# Altium schematic sheet Microcontroller.SchDoc
size B; Organization: MASA; SheetNumber: 6; SheetTotal: 7
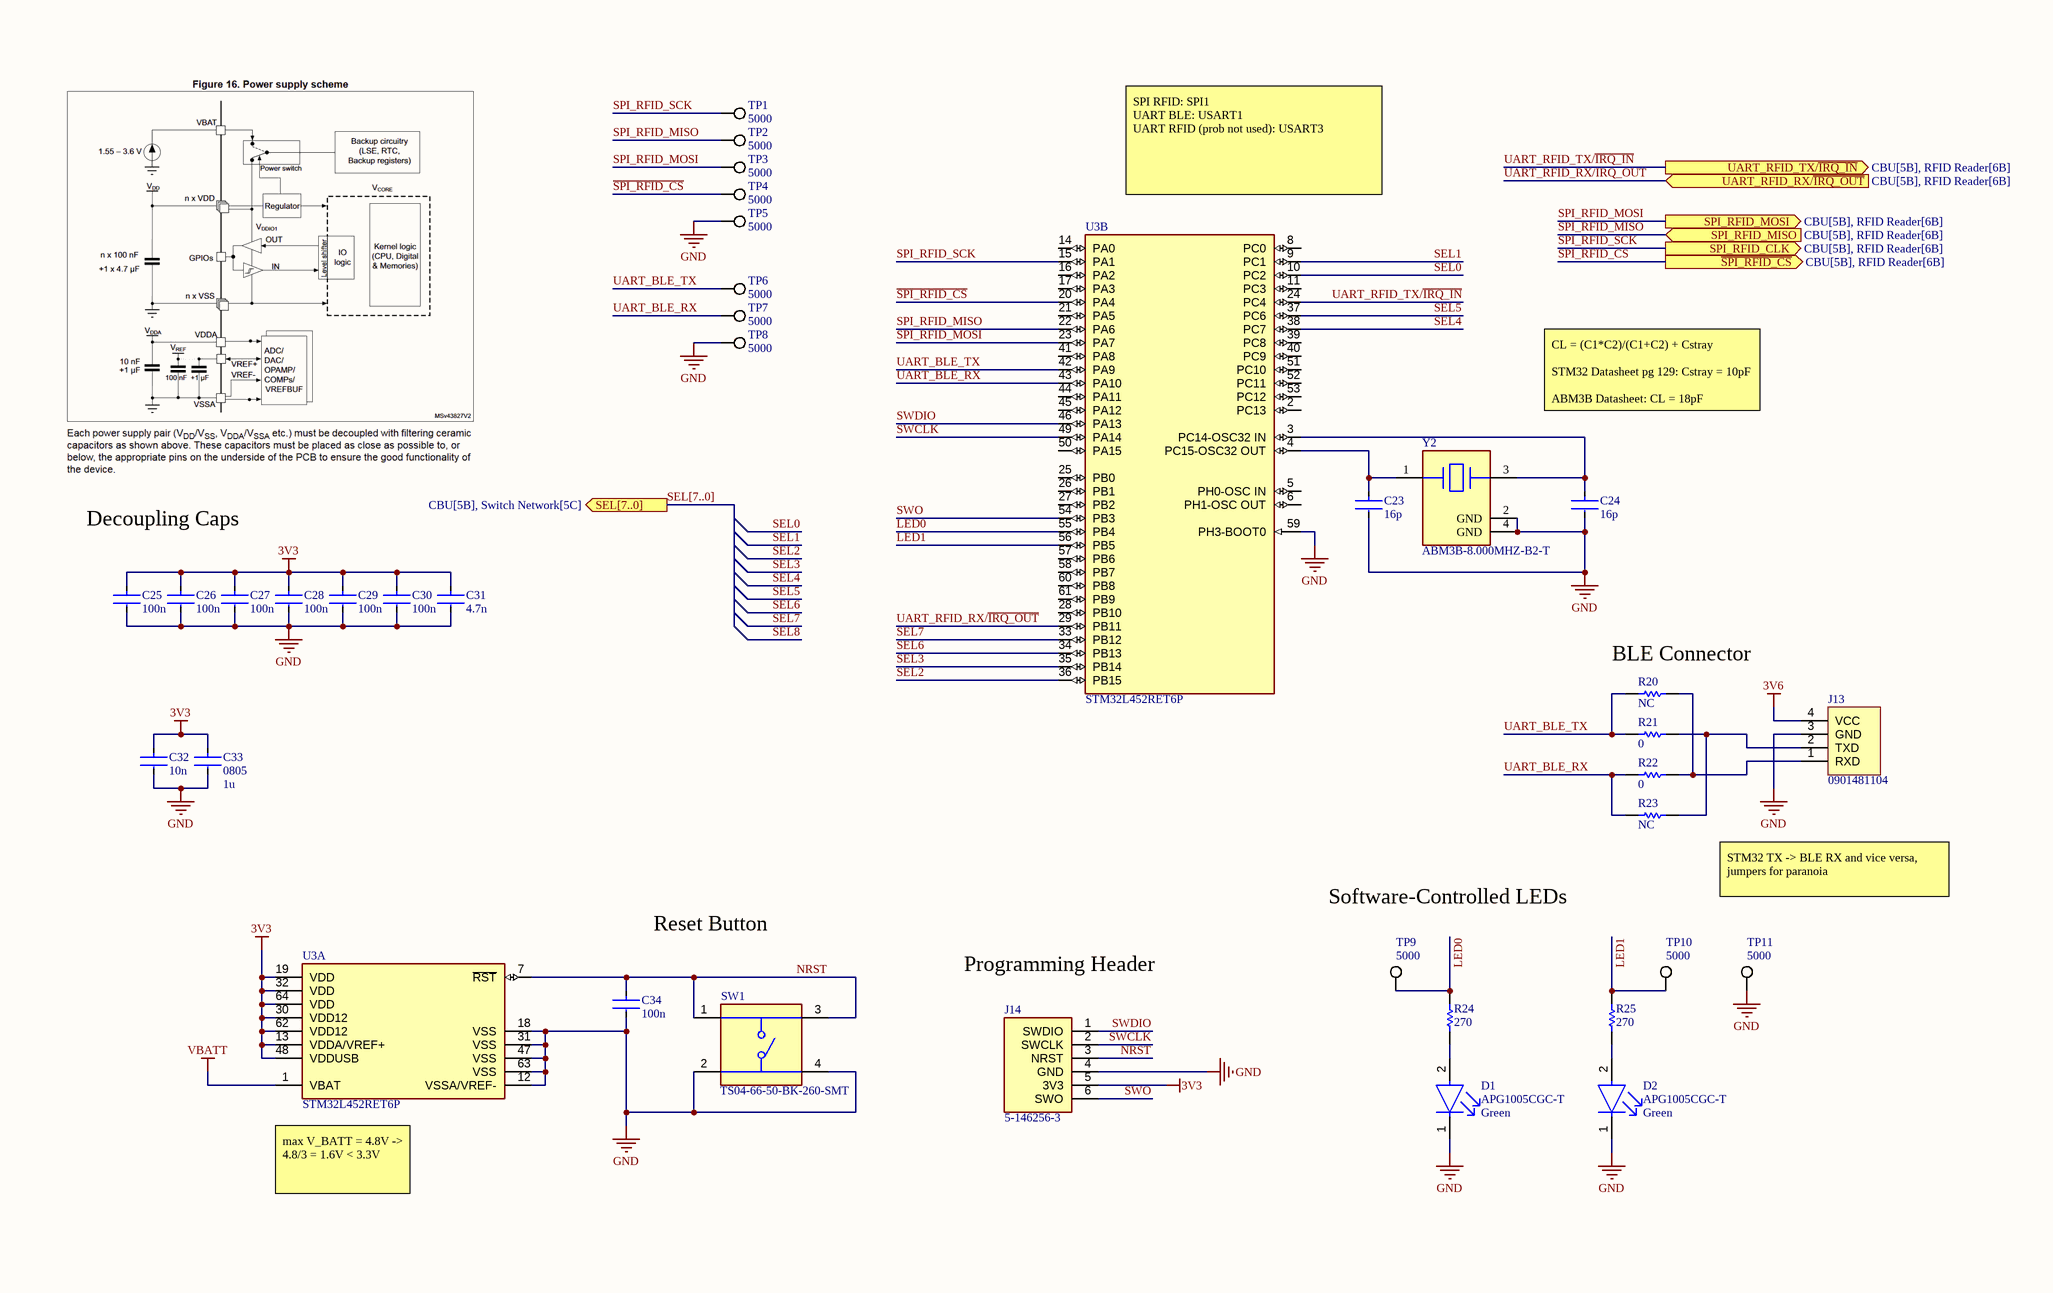
[diagram p0: Microcontroller.SchDoc]

## Parts
C23  value 16p  [FP-0603-Capacitor-CL10-IPC_B]  (hidden comment: Ceramic Capacitor 0603)
C24  value 16p  [FP-0603-Capacitor-CL10-IPC_B]  (hidden comment: Ceramic Capacitor 0603)
C25  value 100n  [FP-0603-Capacitor-CL10-IPC_B]  (hidden comment: Ceramic Capacitor 0603)
C26  value 100n  [FP-0603-Capacitor-CL10-IPC_B]  (hidden comment: Ceramic Capacitor 0603)
C27  value 100n  [FP-0603-Capacitor-CL10-IPC_B]  (hidden comment: Ceramic Capacitor 0603)
C28  value 100n  [FP-0603-Capacitor-CL10-IPC_B]  (hidden comment: Ceramic Capacitor 0603)
C29  value 100n  [FP-0603-Capacitor-CL10-IPC_B]  (hidden comment: Ceramic Capacitor 0603)
C30  value 100n  [FP-0603-Capacitor-CL10-IPC_B]  (hidden comment: Ceramic Capacitor 0603)
C31  value 4.7n  [FP-0603-Capacitor-CL10-IPC_B]  (hidden comment: Ceramic Capacitor 0603)
C32  value 10n  [FP-0603-Capacitor-CL10-IPC_B]  (hidden comment: Ceramic Capacitor 0603)
C33  value 1u  Package: 0805  [FP-0805-Capacitor-CL21-IPC_B]  (hidden comment: Ceramic Capacitor 0805)
C34  value 100n  [FP-0603-Capacitor-CL10-IPC_B]  (hidden comment: Ceramic Capacitor 0603)
D1  APG1005CGC-T  Color: Green  [FP-APG1005CGC-T-MFG]
D2  APG1005CGC-T  Color: Green  [FP-APG1005CGC-T-MFG]
J13  0901481104  [0901481104]
J14  5-146256-3  [TE_5-146256-3]
R20  value NC  [RESC1608X55X25NL10T15]  (hidden comment: RC0603FR-072K2L)
R21  value 0  [RESC1608X55X25NL10T15]  (hidden comment: RC0603FR-072K2L)
R22  value 0  [RESC1608X55X25NL10T15]  (hidden comment: RC0603FR-072K2L)
R23  value NC  [RESC1608X55X25NL10T15]  (hidden comment: RC0603FR-072K2L)
R24  value 270  [RESC1608X55X25NL10T15]  (hidden comment: RC0603FR-072K2L)
R25  value 270  [RESC1608X55X25NL10T15]  (hidden comment: RC0603FR-072K2L)
SW1  TS04-66-50-BK-260-SMT  [SW_TS04-66-50-BK-260-SMT]
TP1  5000  [FP-5000-MFG]
TP2  5000  [FP-5000-MFG]
TP3  5000  [FP-5000-MFG]
TP4  5000  [FP-5000-MFG]
TP5  5000  [FP-5000-MFG]
TP6  5000  [FP-5000-MFG]
TP7  5000  [FP-5000-MFG]
TP8  5000  [FP-5000-MFG]
TP9  5000  [FP-5000-MFG]
TP10  5000  [FP-5000-MFG]
TP11  5000  [FP-5000-MFG]
U3  STM32L452RET6P  [FP-STM32L452RET6P-MFG]  (parts A,B of 2)
Y2  ABM3B-8.000MHZ-B2-T  [FP-ABM3B-MFG]

## Ports
SEL[7..0] (out, see CBU[5B], Switch Network[5C]), SPI_RFID_CLK (out, see CBU[5B], RFID Reader[6B]), SPI_RFID_MISO (in, see CBU[5B], RFID Reader[6B]), SPI_RFID_MOSI (out, see CBU[5B], RFID Reader[6B]), UART_RFID_RX/~{IRQ_OUT} (in, see CBU[5B], RFID Reader[6B]), UART_RFID_TX/~{IRQ_IN} (out, see CBU[5B], RFID Reader[6B]), ~{SPI_RFID_CS} (out, see CBU[5B], RFID Reader[6B])

## Nets
3V3: C25.1 C26.1 C27.1 C28.1 C29.1 C30.1 C31.1 C32.1 C33.1 J14.5(3V3) U3.13(VDDA/VREF+) U3.19(VDD) U3.30(VDD12) U3.32(VDD) U3.48(VDDUSB) U3.62(VDD12) U3.64(VDD)
3V6: J13.4(VCC)
GND: C23.2 C24.2 C25.2 C26.2 C27.2 C28.2 C29.2 C30.2 C31.2 C32.2 C33.2 C34.2 D1.1(C) D2.1(C) J13.3(GND) J14.4(GND) SW1.2 SW1.4 TP5.1 TP8.1 TP11.1 U3.12(VSSA/VREF-) U3.18(VSS) U3.31(VSS) U3.47(VSS) U3.59(PH3-BOOT0) U3.63(VSS) Y2.2(GND) Y2.4(GND)
VBATT: U3.1(VBAT)
LED0: R24.2 TP9.1 U3.55(PB4)
LED1: R25.2 TP10.1 U3.56(PB5)
NRST: C34.1 J14.3(NRST) SW1.1 SW1.3 U3.7(~{RST})
~{SPI_RFID_CS}: TP4.1 U3.20(PA4) ; port ~{SPI_RFID_CS}
SEL0: U3.10(PC2)
SEL1: U3.9(PC1)
SEL2: U3.36(PB15)
SEL3: U3.35(PB14)
SEL4: U3.38(PC7)
SEL5: U3.37(PC6)
SEL6: U3.34(PB13)
SEL7: U3.33(PB12)
SPI_RFID_MISO: TP2.1 U3.22(PA6) ; port SPI_RFID_MISO
SPI_RFID_MOSI: TP3.1 U3.23(PA7) ; port SPI_RFID_MOSI
SPI_RFID_SCK: TP1.1 U3.15(PA1) ; port SPI_RFID_CLK
SWCLK: J14.2(SWCLK) U3.49(PA14)
SWDIO: J14.1(SWDIO) U3.46(PA13)
SWO: J14.6(SWO) U3.54(PB3)
UART_BLE_RX: R22.2 R23.1 TP7.1 U3.43(PA10)
UART_BLE_TX: R20.2 R21.1 TP6.1 U3.42(PA9)
UART_RFID_RX/~{IRQ_OUT}: U3.29(PB11) ; port UART_RFID_RX/~{IRQ_OUT}
UART_RFID_TX/~{IRQ_IN}: U3.24(PC4) ; port UART_RFID_TX/~{IRQ_IN}
NetC23_1: C23.1 U3.4(PC15-OSC32_OUT) Y2.1
NetC24_1: C24.1 U3.3(PC14-OSC32_IN) Y2.3
NetD1_2: D1.2(A) R24.1
NetD2_2: D2.2(A) R25.1
NetJ13_1: J13.1(RXD) R20.1 R22.1
NetJ13_2: J13.2(TXD) R21.2 R23.2

Not connected (* = marked no-connect by the designer): U3 2(PC13) 5(PH0-OSC_IN) 6(PH1-OSC_OUT) 8(PC0) 11(PC3) 14(PA0) 16(PA2) 17(PA3) 21(PA5) 25(PB0) 26(PB1) 27(PB2) 28(PB10) 39(PC8) 40(PC9) 41(PA8) 44(PA11) 45(PA12) 50(PA15) 51(PC10) 52(PC11) 53(PC12) 57(PB6) 58(PB7) 60(PB8) 61(PB9)

## Buses and harness runs
bus SEL[7..0] = port SEL[7..0]

## Notes on the sheet
- SPI RFID: SPI1
  UART BLE: USART1
  UART RFID (prob not used): USART3
- CL = (C1*C2)/(C1+C2) + Cstray
  STM32 Datasheet pg 129: Cstray = 10pF
  ABM3B Datasheet: CL = 18pF
- Decoupling Caps
- (near R20) BLE Connector
- Software-Controlled LEDs
- STM32 TX -> BLE RX and vice versa, jumpers for paranoia
- Reset Button
- Programming Header
- (near U3) max V_BATT = 4.8V -> 4.8/3 = 1.6V < 3.3V
- DWG. NO.
- REV.
- SHT.
- THIS DOCUMENT AND THE DATA DISCLOSED HEREIN OR HEREWITH IS THE PROPERTY OF ALTIUM LIMITED AND MAY BE FREELY DISTRIBUTED IN WHOLE. NO RIGHTS ARE RESERVED OR EXPRESS OR IMPLIED WARANTEE GIVEN.
- REVISION
- DESCRIPTION
- DATE
- APPROVED
- ENG:
- APPROVALS
- PROJECT
- DSN:
- CHK:
- REFERENCE DOCUMENTS
- PROJECT REVISION:
- TITLE
- DOCUMENT REVISION:
- DESIGN ITEM:
- BOM:
- FAB DWG:
- PCB DWG:
- ASSY DWG:
- SCALE:
- SIZE
- B
- CAGE CODE
- FILE NAME
- DWG NO.
- SHEET
- OF
- REV

## Library data of the parts
C23-C32 C34 = Ceramic Capacitor 0603: CAP CER 50V X7R 0603; Manufacturer: KEMET; Manufacturer Part Number: C0603C104K5RACTU; Tolerance: 0.1; Temperature Coefficient: 30ppm/°C; Automotive Grade: Grade 1; Temperature: -55°C to +125°C; RoHS: TRUE; Material: Ceramic; Temperature Range High: +125°C; Lead Free: Yes; Octopart: https://octopart.com/c0603c104k5ractu-kemet-139244; Digikey Description: CAP CER 0.1UF 50V X7R 0603; Category: Cap; Package: C0603C-CF; ComponentLink2Description: Datasheet; Temperature Range Low: -55°C; Device Class L1: Passive Components; Voltage Rating: 50 V; Automotive: Yes; Device Class L3: Ceramic Capacitors; ComponentLink2URL: https://api.kemet.com/component-edge/download/datasheet/C0603C100J5GACAUTO.pdf; Device Class L2: Capacitors; Temperature Characteristic: X7R; Height: 0.87mm
  C23 C24: Supplier 1: Arrow Electronics; Supplier Part Number 1: CL10B104KB8NNNC
  C25-C32 C34: Supplier 1: Mouser; Supplier Part Number 1: 80-C0201C120K3G
C33 = Ceramic Capacitor 0805: CAP CER 50V X7R 0805; Manufacturer: KEMET; Manufacturer Part Number: C0603C104K5RACTU; Tolerance: 0.1; Temperature Coefficient: 30ppm/°C; Automotive Grade: Grade 1; Temperature: -55°C to +125°C; RoHS: TRUE; Material: Ceramic; Temperature Range High: +125°C; Lead Free: Yes; Octopart: https://octopart.com/c0603c104k5ractu-kemet-139244; Digikey Description: CAP CER 0.1UF 50V X7R 0603; Category: Cap; ComponentLink2Description: Datasheet; Temperature Range Low: -55°C; Device Class L1: Passive Components; Voltage Rating: 50 V; Automotive: Yes; Device Class L3: Ceramic Capacitors; ComponentLink2URL: https://api.kemet.com/component-edge/download/datasheet/C0603C100J5GACAUTO.pdf; Device Class L2: Capacitors; Temperature Characteristic: X7R; Height: 0.87mm; Supplier 1: Arrow Electronics; Supplier Part Number 1: CL21B105KBFNNNG
D1 D2 = APG1005CGC-T: LED GREEN CLEAR CHIP SMD; Forward Voltage: 2V; Lens Color: Colorless; Test Current: 20mA; Dominant Wavelength: 571nm; Viewing Angle: 120°; Luminous Intensity: 35mcd; Width: 0.5mm; Case Code (Imperial): 0402; Package Quantity: 1; Case/Package: 0402; Packaging: Tape and Reel; Height: 0.25mm; Mount: Surface Mount; Case Code (Metric): 1005; Length: 1mm; Lead Free: Lead Free; Lens Transparency: Clear; Supplier 1: Digi-Key; Supplier Part Number 1: 754-1811-1-ND
J13 = 0901481104: 4 Position Receptacle Connector 0.100" (2.54mm) Through Hole, Right Angle Tin, connector for DSD TECH HM-10 Bluetooth 4.0 BLE iBeacon UART Module with 4PIN Base Board for Arduino UNO R3 Mega 2560 Nan; Supplier 1: Mouser; Supplier Part Number 1: 538-90148-1104
J14 = 5-146256-3: Header; Breakaway; 0.100 x 0.100 in.; PC Board; Dual; 6; 0.025 in.; 0.12 in.; Centerline_Pitch: 2.54 mm[.1 in]; Number_of_Positions: 6; MF: TE Connectivity; Product_Type: Connector; TE_purchase_URL: https://www.te.com/usa-en/product-5-146256-3.html?te_bu=Cor&te_type=disp&te_campaign=seda_glo_cor-seda-global-disp-prtnr-fy19-seda-model-bom-cta_sma-317_1&elqCampaignId=32493; SnapEDA_Link: https://www.snapeda.com/parts/5-146256-3/TE%20Connectivity/view-part/486039/?ref=snap; EU_RoHS_Compliance: Compliant; MP: 5-146256-3; Value: *; Package: None; Digi-Key_Part_Number: A121369-ND; Digi-Key_Purchase_URL: https://www.digikey.com/product-detail/en/te-connectivity-amp-connectors/5-146256-3/A121369-ND/1153559?utm_source=snapeda&utm_medium=aggregator&utm_campaign=symbol; Supplier 1: Arrow Electronics; Supplier Part Number 1: 5-146256-3
R20-R25 = Resistor 0603: Thick Film Resistor, 2.2 KOhm, 100 mW, 50 V, +/- 1%, -55 to 155 degC, 2-Pin SMD (0603), RoHS, Tape and Reel; Manufacturer: Yageo; Temperature Coefficient: 100PPM/C; Voltage Rating: 50V; Power Rating: 100mW; Tolerance: 1%; Datasheet Version: Rev. 7, 05/2017; Case Code - mm: 1608; Series: RC; Mounting Technology: SurfaceMount; Package Description: 2-Pin Surface Mount Device, Body 1.6 x 0.8 mm; Case Code - in: 0603; Package Reference: 0603; Product: ThickFilmResistorsGeneralPurpose; Manufacturer URL: http://www.yageo.com/; Termination Style: SMD/SMT; Operating Temperature Range: -55Cto+155C; Datasheet URL: http://www.yageo.com/documents/recent/PYu-RC_Group_51_RoHS_L_7.pdf; Packaging: Reel
SW1 = TS04-66-50-BK-260-SMT: Tactile Switch SPST-NO Top Actuated Surface Mount; Value: *; MP: TS04-66-50-BK-260-SMT; Package: None; Availability: Unavailable; Price: None; Supplier 1: Mouser; Supplier Part Number 1: 179-TS046650BK260SMT
TP1-TP11 = 5000: Red PC Test Point, Miniature Phosphor Bronze Silver Plating Through Hole Mounting Type; Connector Type: Interconnection Device; Contact Finish - Termination: Silver (Ag); Reach SVHC Compliant: Yes; JESD-609 Code: e4; RoHS Compliant: Yes; Pins: 1; Mounting Technology: THT; Supplier 1: Future Electronics; Supplier Part Number 1: 8000564
U3 = STM32L452RET6P: IC MCU 32BIT 512KB FLASH 64LQFP; Manufacturer: STMicroelectronics; Frequency: 80MHz; Number Of Adc Channels: 16; Ram Size: 160KBytes; Max Junction Temp: +105°C; Number Of I2C Channels: 4; Number Of Cores: 1; Number Of I/Os: 52; Data Bus Width: 32bits; Max Supply Voltage: 3.6V; Standoff Height: 0.05mm; Min Supply Voltage: 1.05V; Core Architecture: ARM Cortex-M4; Memory Size: 512KBytes; Number Of Spi Channels: 3; Interface: I2C,SPI,UART,USART,CAN,USB,LIN,IrDA,Other; Number Of Pwm Channels: 20; Number Of Uart Channels: 5; Number Of Timers/Counters: 8; Ambient Temperature Range High: +85°C; Height: 1.6mm; Memory Type: FLASH; ComponentLink2Description: Datasheet; Number Of Usb Channels: 1; Number Of A/D Converters: 1; Automotive: No; RoHS: TRUE; ComponentLink2URL: https://www.st.com/resource/en/datasheet/stm32l452re.pdf; Digikey Description: IC MCU 32BIT 512KB FLASH 64LQFP; Temperature Range High: +105°C; Category: IC; Octopart: https://octopart.com/stm32l452ret6p-stmicroelectronics-82945027; Device Class L1: Integrated Circuits (ICs); Manufacturer Part Number: STM32L452RET6P; Temperature Range Low: -40°C; Device Class L3: Microcontrollers; Temperature: -40°C to +105°C; Device Class L2: Embedded Processors and Controllers; Ambient Temperature Range Low: -40°C; Lead Free: Yes; Package: LQFP64; Supplier 1: Mouser; Supplier Part Number 1: 511-STM32L452RET6P
Y2 = ABM3B-8.000MHZ-B2-T: Crystal 8MHz ±20ppm 18pF SMD-4 5mm x 3.2mm; ESR (Equivalent Series Resistance): 200R; Frequency Stability: 50ppm; Operating Frequency: 8 MHz; Mount: Surface Mount; Number of Pins: 4; Packaging: Tape and Reel; Width: 0.126inch; Case/Package: CSMD; Lead Free: Lead Free; Depth: 3.2mm; Load Capacitance: 18pF; Min Operating Temperature: -20°C; Series: ABM3B; Package Quantity: 1000; Resistor Type: Ceramic; Height: 0.043inch; Max Operating Temperature: 70°C; Frequency Tolerance: 20ppm; Series Resistance: 200R; Tolerance: 20ppm; Termination: SMD/SMT; Length: 5mm; Frequency: 8MHz; Supplier 1: Future Electronics; Supplier Part Number 1: 2481760